# Altium schematic sheet OTHER.SchDoc
size 420 x 297 mm; DocumentNumber: АЕСН.466369.100Э3; SheetNumber: 3; SheetTotal: x; DocumentName: Sheet1.SCHDOC
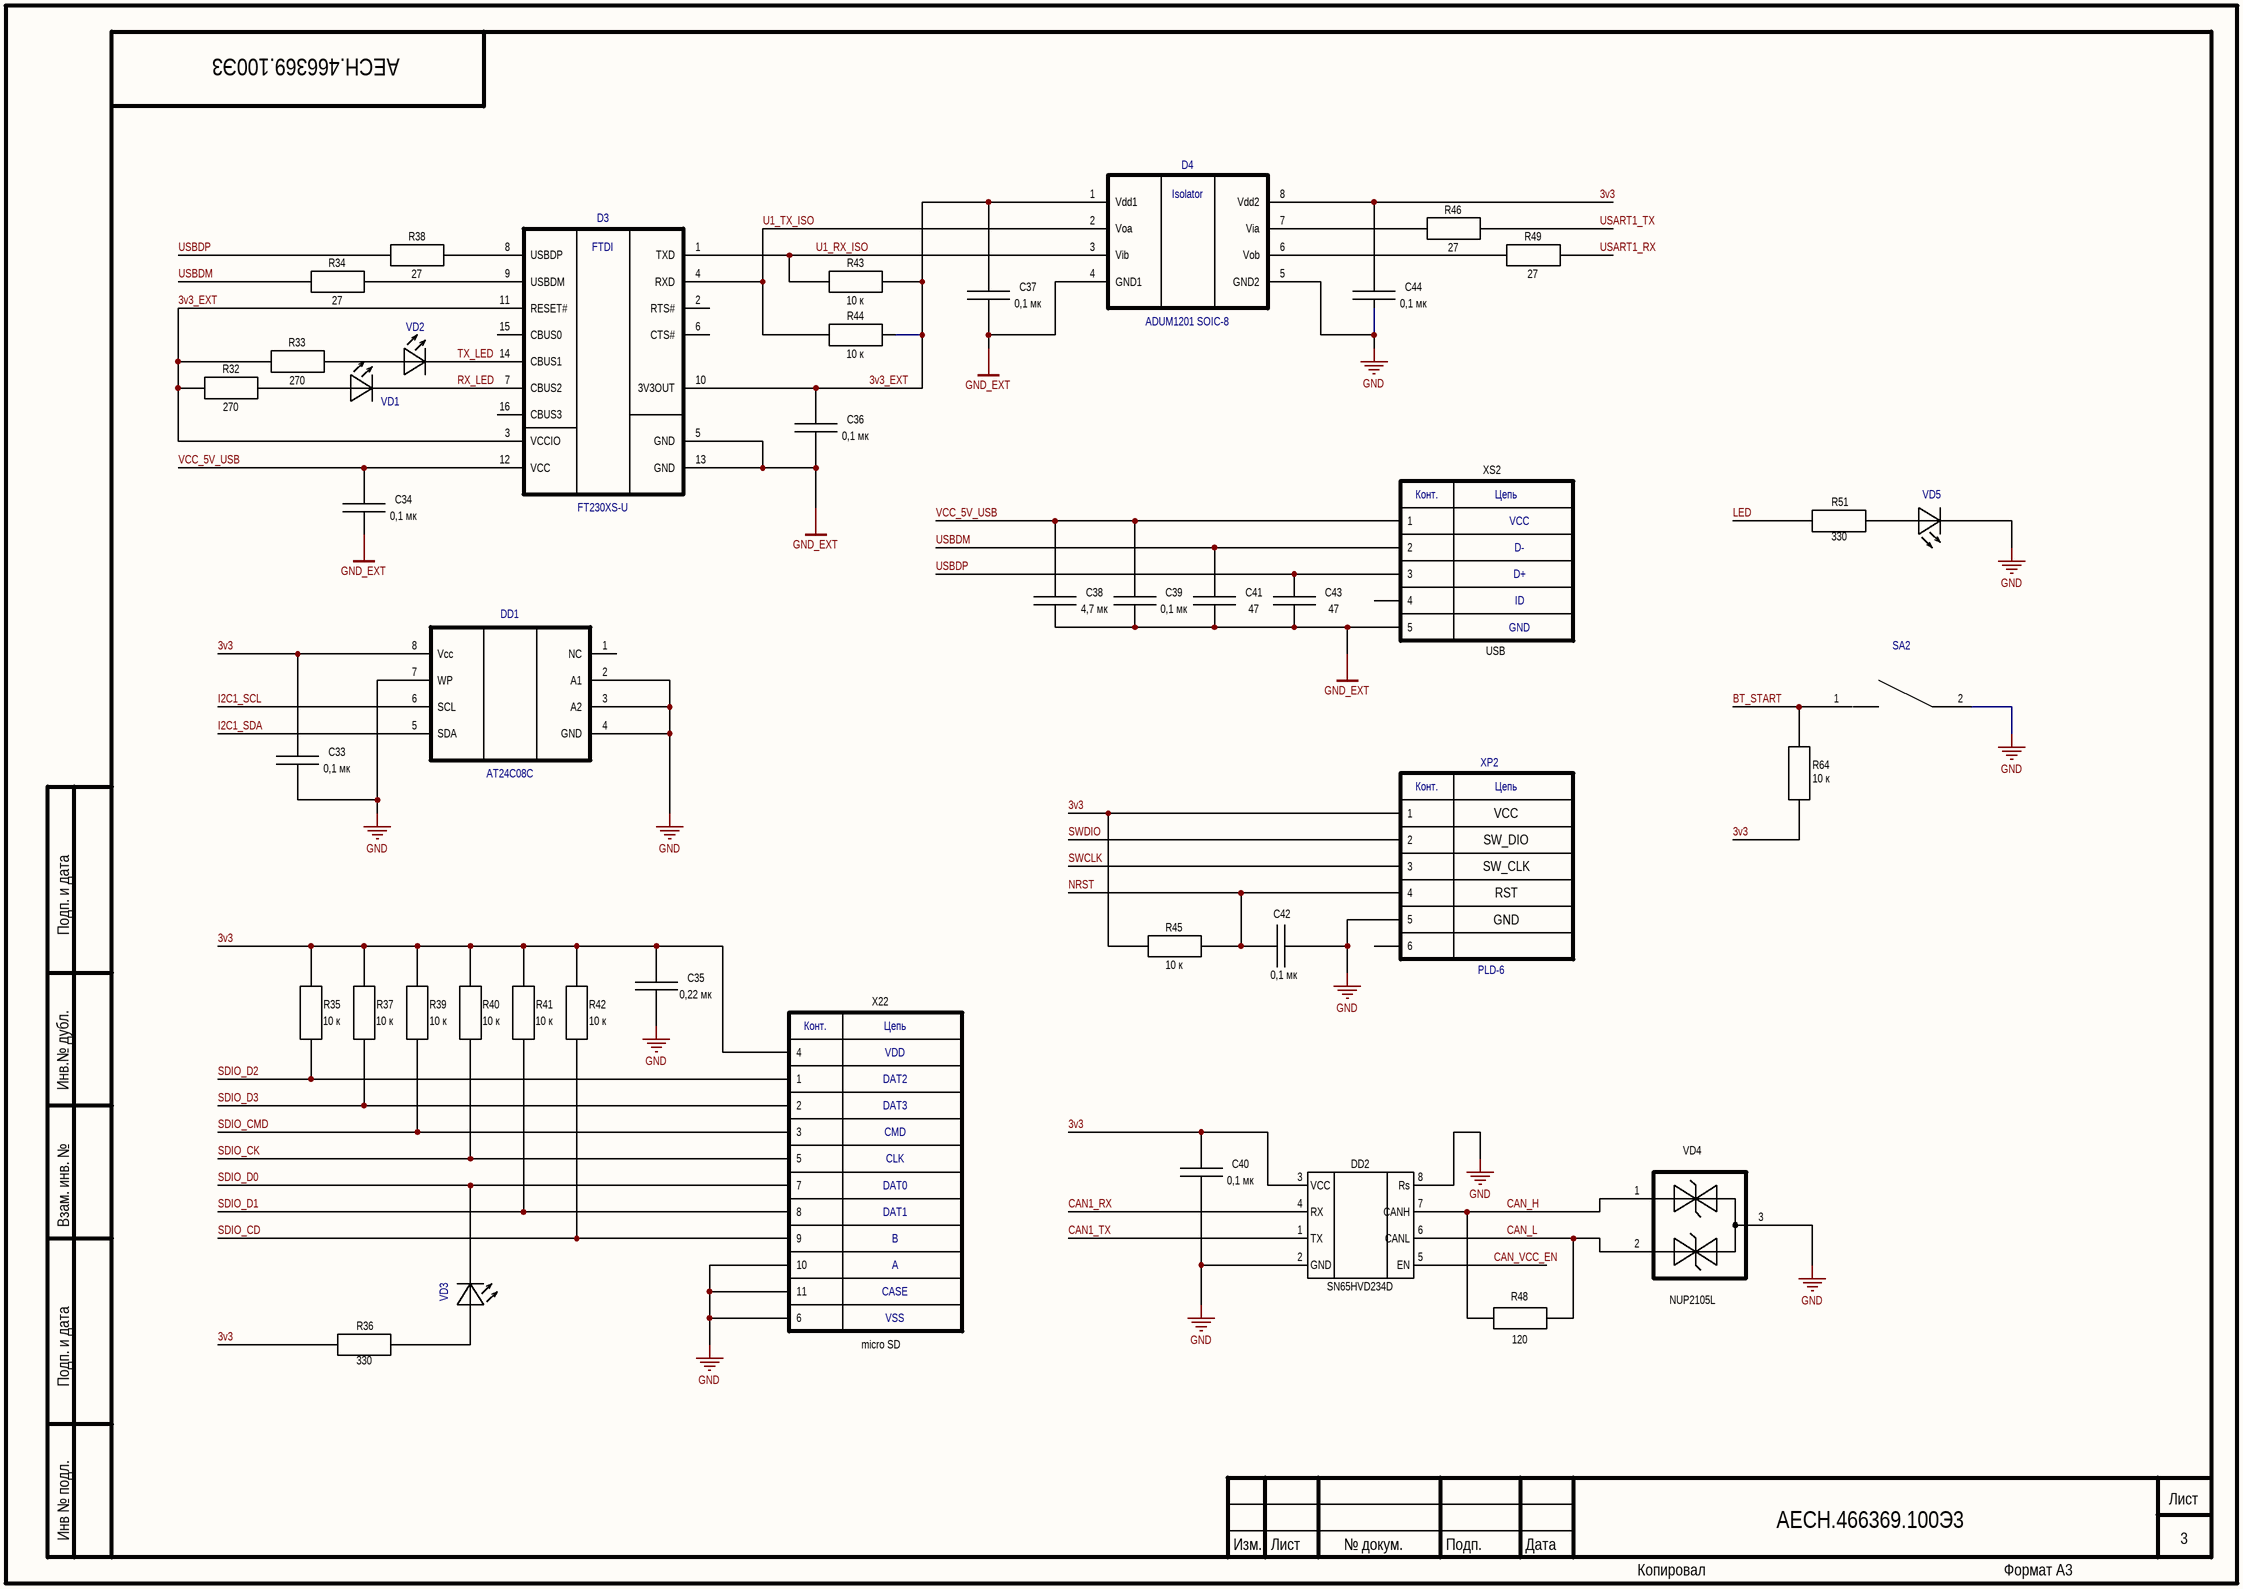
[diagram p0: OTHER.SchDoc]

## Parts
C33  value 0,1 мк  [C0603]  (hidden comment: C)
C34  value 0,1 мк  [C0603]  (hidden comment: C)
C35  value 0,22 мк  [C0603]  (hidden comment: C)
C36  value 0,1 мк  [C0603]  (hidden comment: C)
C37  value 0,1 мк  [C0603]  (hidden comment: C)
C38  value 4,7 мк  [C0603]  (hidden comment: C)
C39  value 0,1 мк  [C0603]  (hidden comment: C)
C40  value 0,1 мк  [C0603]  (hidden comment: C)
C41  value 47  [C0603]  (hidden comment: C)
C42  value 0,1 мк  [C0603]  (hidden comment: C)
C43  value 47  [C0603]  (hidden comment: C)
C44  value 0,1 мк  [C0603]  (hidden comment: C)
D3  FT230XS-U  [SSOP-16]
D4  ADUM1201 SOIC-8  [SOIC8]
DD1  AT24C08C  [SOIC8]
DD2  SN65HVD234D  [SOIC8]
R32  value 270  [R0603]  (hidden comment: R)
R33  value 270  [R0603]  (hidden comment: R)
R34  value 27  [R0603]  (hidden comment: R)
R35  value 10 к  [R0603]  (hidden comment: R)
R36  value 330  [R0603]  (hidden comment: R)
R37  value 10 к  [R0603]  (hidden comment: R)
R38  value 27  [R0603]  (hidden comment: R)
R39  value 10 к  [R0603]  (hidden comment: R)
R40  value 10 к  [R0603]  (hidden comment: R)
R41  value 10 к  [R0603]  (hidden comment: R)
R42  value 10 к  [R0603]  (hidden comment: R)
R43  value 10 к  [R0603]  (hidden comment: R)
R44  value 10 к  [R0603]  (hidden comment: R)
R45  value 10 к  [R0603]  (hidden comment: R)
R46  value 27  [R0603]  (hidden comment: R)
R48  value 120  [R1206]  (hidden comment: R)
R49  value 27  [R0603]  (hidden comment: R)
R51  value 330  [R0603]  (hidden comment: R)
R64  value 10 к  [R0603]  (hidden comment: R)
SA2  Button  [KLS7_6x6]  (value not drawn)
VD1  LED  [LED_0603_YELLOW]  (value not drawn)
VD2  LED  [LED_0603_GREEN]  (value not drawn)
VD3  LED  [LED_0603_BLUE]  (value not drawn)
VD4  NUP2105L  [SOT-23]
VD5  LED  [LED_0603_RED]  (value not drawn)
X22  micro SD  [DM3AT-SF-PEJM5]
XP2  PLD-6  [PLD-6]
XS2  USB  [USB_MICRO_1981568-1]

## Nets
GND: C33.2 C35.2 C40.2 C42.2 C44.2 D4.5(GND2) DD1.2(A1) DD1.3(A2) DD1.4(GND) DD1.7(WP) DD2.2(GND) DD2.8(Rs) SA2.2 VD4.3(AC) VD5.2(C) X22.6 X22.10 X22.11 XP2.5
GND_EXT: C34.2 C36.2 C37.2 C38.2 C39.2 C41.2 C43.2 D3.5(GND) D3.13(GND) D4.4(GND1) XS2.5
3v3: C33.1 C35.1 C40.1 C44.1 D4.8(Vdd2) DD1.8(Vcc) DD2.3(VCC) R35.2 R36.2 R37.2 R39.2 R40.2 R41.2 R42.2 R45.1 R64.1 X22.4 XP2.1
3v3_EXT: C36.1 C37.1 D3.3(VCCIO) D3.10(3V3OUT) D3.11(RESET#) D4.1(Vdd1) R32.1 R33.1 R43.2 R44.2
BT_START: R64.2 SA2.1
CAN1_RX: DD2.4(RX)
CAN1_TX: DD2.1(TX)
CAN_H: DD2.7(CANH) R48.1 VD4.1(A)
CAN_L: DD2.6(CANL) R48.2 VD4.2(C)
CAN_VCC_EN: DD2.5(EN)
I2C1_SCL: DD1.6(SCL)
I2C1_SDA: DD1.5(SDA)
LED: R51.2
NRST: C42.1 R45.2 XP2.4
RX_LED: D3.7(CBUS2) VD1.2(C)
SDIO_CD: R42.1 X22.9
SDIO_CK: R40.1 X22.5
SDIO_CMD: R39.1 X22.3
SDIO_D0: VD3.2(C) X22.7
SDIO_D1: R41.1 X22.8
SDIO_D2: R35.1 X22.1
SDIO_D3: R37.1 X22.2
SWCLK: XP2.3
SWDIO: XP2.2
TX_LED: D3.14(CBUS1) VD2.2(C)
U1_RX_ISO: D3.1(TXD) D4.3(Vib) R43.1
U1_TX_ISO: D3.4(RXD) D4.2(Voa) R44.1
USART1_RX: R49.2
USART1_TX: R46.2
USBDM: C41.1 R34.1 XS2.2
USBDP: C43.1 R38.1 XS2.3
VCC_5V_USB: C34.1 C38.1 C39.1 D3.12(VCC) XS2.1
NetD3_8: D3.8(USBDP) R38.2
NetD3_9: D3.9(USBDM) R34.2
NetD4_6: D4.6(Vob) R49.1
NetD4_7: D4.7(Via) R46.1
NetR32_2: R32.2 VD1.1(A)
NetR33_2: R33.2 VD2.1(A)
NetR36_1: R36.1 VD3.1(A)
NetR51_1: R51.1 VD5.1(A)

Not connected (* = marked no-connect by the designer): D3 2(RTS#) 6(CTS#) 15(CBUS0) 16(CBUS3); DD1 1(NC); XP2 6; XS2 4

## Notes on the sheet
- VCC
- SW_DIO
- SW_CLK
- RST
- GND
- Подп. и дата
- Инв.№ дубл.
- Взам. инв. №
- Инв № подл.
- Изм.
- Лист
- № докум.
- Подп.
- Дата
- Копировал
- Формат А3
- (in symbol 6pin) Конт.; Цепь
- (in symbol ADUM1201) Isolator
- (in symbol FT230XS-U) FTDI
- (in symbol microSD) Конт.; Цепь; VDD; DAT2; DAT3; CMD; CLK; DAT0; DAT1; B; A; CASE; VSS
- (in symbol USB) Конт.; Цепь; VCC; D-; D+; ID; GND

## Library data of the parts
C33 C34 C36 C37 C39 C40 C42 C44 = C: PartNumber: GRM188R71H104KA93D; Tolerance: ±10%; Voltage: 50 В; Dielectric: X7R; Case: 0603; Mount: *
C35 = C: PartNumber: GRM188R71E224KA88D; Tolerance: ±10%; Voltage: 25 В; Dielectric: X7R; Case: 0603; Mount: *
C38 = C: PartNumber: GRM188Z71C475KE21D; Tolerance: ±10%; Voltage: 16 В; Dielectric: X7R; Case: 0603; Mount: *
C41 C43 = C: PartNumber: GRM1885C1H470FA01D; Tolerance: ±10%; Voltage: 50 В; Dielectric: NP0; Case: 0603; Mount: *
D4 = ADUM1201
DD1 = AT24C0xC
DD2 = SN65HVD234D: CAN
R32 R33 = R: PartNumber: RC0603JR-07270RL; Tolerance: ±5%; Power: 0.1 Вт; Case: 0603
R34 R38 R46 R49 = R: PartNumber: RC0603JR-0727RL; Tolerance: ±5%; Power: 0.1 Вт; Case: 0603
R35 R37 R39-R45 R64 = R: PartNumber: RC0603JR-0710KL; Tolerance: ±5%; Power: 0.1 Вт; Case: 0603
R36 R51 = R: PartNumber: RC0603JR-07330RL; Tolerance: ±5%; Power: 0.1 Вт; Case: 0603
R48 = R: PartNumber: RC1206JR-13120RL; Tolerance: ±5%; Power: 0.25 Вт; Case: 1206
X22 = microSD
XP2 = 6pin: Manufacturer: *; PartNumber: PLD-6